# Altium project RobotHead.PrjPcb
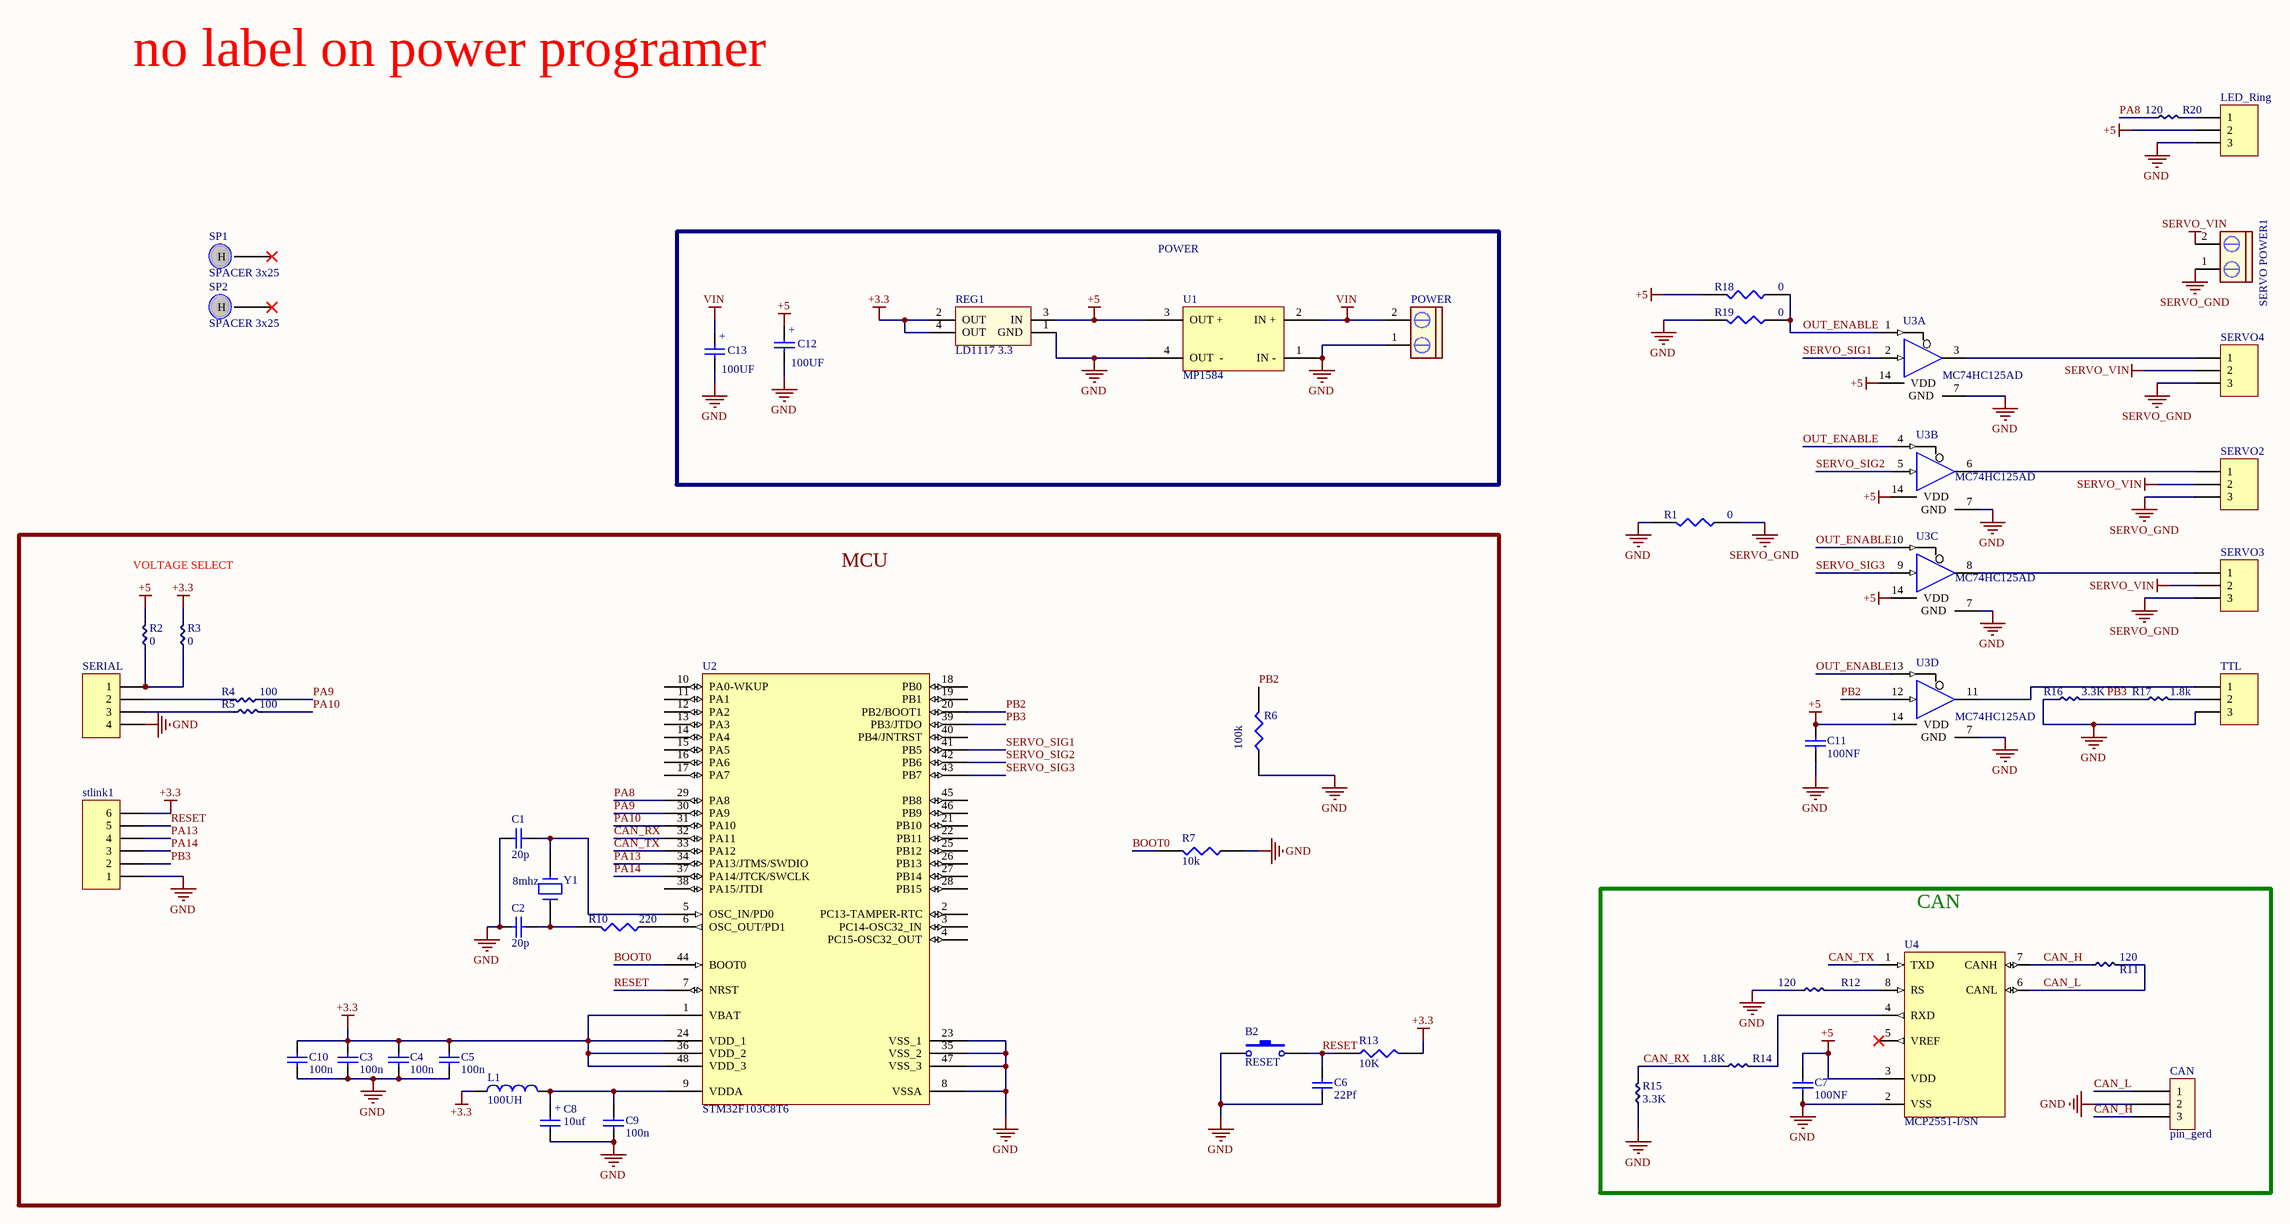
[diagram p0: Head.SchDoc]
1 sheet, 51 parts. Net scope: global (net labels, ports and power ports of the same name join across sheets).
Board file: HEAD.PcbDoc

## Sheet Head.SchDoc
size A2

### Parts
B2  RESET  [SMD PUSH BUTTON]
C1  20p  [MY_CAP_SMD_0805]
C2  20p  [MY_CAP_SMD_0805]
C3  100n  [MY_CAP_SMD_0805]
C4  100n  [MY_CAP_SMD_0805]
C5  100n  [MY_CAP_SMD_0805]
C6  22Pf  [MY_CAP_SMD_0805]
C7  100NF  [MY_CAP_SMD_0805]
C8  10uf  [MY_cap_smd10uf]
C9  100n  [MY_CAP_SMD_0805]
C10  100n  [MY_CAP_SMD_0805]
C11  100NF  [MY_CAP_SMD_0805]
C12  100UF  [MY_CAP_POL 5MM]
C13  100UF  [MY_CAP_POL 5MM]
CAN  pin_gerd  [MY_PINGERD3]
L1  100UH  [MY_SMD_INDUCTOR]
LED_Ring  Header 3  [My_1X03]  (value not drawn)
POWER  CON2 pin blue  [My_CN2]  (value not drawn)
R1  0  [MY_RES_SMD_0805]
R2  0  [MY_RES_SMD_0805]
R3  0  [MY_RES_SMD_0805]
R4  100  [MY_RES_SMD_0805]
R5  100  [MY_RES_SMD_0805]
R6  100k  [MY_RES_SMD_0805]
R7  10k  [MY_RES_SMD_0805]
R10  220  [MY_RES_SMD_0805]
R11  120  [MY_RES_SMD_0805]
R12  120  [MY_RES_SMD_0805]
R13  10K  [MY_RES_SMD_0805]
R14  1.8K  [MY_RES_SMD_0805]
R15  3.3K  [MY_RES_SMD_0805]
R16  3.3K  [MY_RES_SMD_0805]
R17  1.8k  [MY_RES_SMD_0805]
R18  0  [MY_RES_SMD_0805]
R19  0  [MY_RES_SMD_0805]
R20  120  [MY_RES_SMD_0805]
REG1  LD1117 3.3  [MY_LD1117-3.3]
SERIAL  Header 4  [My_1X04]  (value not drawn)
SERVO2  Header 3  [My_1X03]  (value not drawn)
SERVO3  Header 3  [My_1X03]  (value not drawn)
SERVO4  Header 3  [My_1X03]  (value not drawn)
SERVO_POWER1  CON2 pin blue  [My_CN2]  (value not drawn)
SP1  SPACER 3x25  [MY_SPACER 3X25MM]
SP2  SPACER 3x25  [MY_SPACER 3X25MM]
stlink1  Header 6  [My_1X06]  (value not drawn)
TTL  Header 3  [My_1X03]  (value not drawn)
U1  MP1584  [mp1584]
U2  STM32F103C8T6  [LQFP48_N]
U3  MC74HC125AD  [751A-02_N]  (parts A,B,C,D of 4)
U4  MCP2551-I/SN  [SOIC-SN8_N]
Y1  8mhz  [My_Crystal - SMD]

### Blocks framed on the sheet
POWER: C12 C13 POWER REG1 U1
MCU: B2 C1-C6 C8-C10 L1 R2-R7 R10 R13 SERIAL stlink1 U2 Y1
CAN: C7 CAN R11 R12 R14 R15 U4

### Nets
+3.3: C3.2 C4.2 C5.2 C10.2 L1.1 R3.2 R13.2 REG1.2(OUT) REG1.4(OUT) stlink1.6 U2.1(VBAT) U2.24(VDD_1) U2.36(VDD_2) U2.48(VDD_3)
+5: C7.2 C11.2 C12.+ LED_Ring.2 R2.2 R18.2 REG1.3(IN) U1.3(OUT_+) U3.14(VDD) U4.3(VDD)
GND: B2.1 C1.2 C2.1 C3.1 C4.1 C5.1 C6.1 C7.1 C8.- C9.1 C10.1 C11.1 C12.- C13.- CAN.2 LED_Ring.3 POWER.1 R1.2 R6.1 R7.1 R12.1 R15.1 R16.1 R19.2 REG1.1(GND) SERIAL.4 stlink1.1 TTL.3 U1.1(IN_-) U1.4(OUT__-) U2.8(VSSA) U2.23(VSS_1) U2.35(VSS_2) U2.47(VSS_3) U3.7(GND) U4.2(VSS)
SERVO_GND: R1.1 SERVO2.3 SERVO3.3 SERVO4.3 SERVO_POWER1.1
SERVO_VIN: SERVO2.2 SERVO3.2 SERVO4.2 SERVO_POWER1.2
VIN: C13.+ POWER.2 U1.2(IN_+)
BOOT0: R7.2 U2.44(BOOT0)
CAN_H: CAN.3 R11.1 U4.7(CANH)
CAN_L: CAN.1 R11.2 U4.6(CANL)
CAN_RX: R14.1 R15.2 U2.32(PA11)
CAN_TX: U2.33(PA12) U4.1(TXD)
OUT_ENABLE: R18.1 R19.1 U3.1(~{OE}) U3.4(~{OE}) U3.10(~{OE}) U3.13(~{OE})
PA8: R20.1 U2.29(PA8)
PA9: R4.1 U2.30(PA9)
PA10: R5.2 U2.31(PA10)
PA13: stlink1.4 U2.34(PA13/JTMS/SWDIO)
PA14: stlink1.3 U2.37(PA14/JTCK/SWCLK)
PB2: R6.2 U2.20(PB2/BOOT1) U3.12(A)
PB3: R16.2 R17.1 stlink1.2 U2.39(PB3/JTDO)
RESET: B2.2 C6.2 R13.1 stlink1.5 U2.7(NRST)
SERVO_SIG1: U2.41(PB5) U3.2(A)
SERVO_SIG2: U2.42(PB6) U3.5(A)
SERVO_SIG3: U2.43(PB7) U3.9(A)
NetC1_1: C1.1 U2.5(OSC_IN/PD0) Y1.2
NetC2_2: C2.2 R10.2 Y1.1
NetC8_+: C8.+ C9.2 L1.2 U2.9(VDDA)
NetLED_Ring_1: LED_Ring.1 R20.2
NetR2_1: R2.1 R3.1 SERIAL.1
NetR4_2: R4.2 SERIAL.2
NetR5_1: R5.1 SERIAL.3
NetR10_1: R10.1 U2.6(OSC_OUT/PD1)
NetR12_2: R12.2 U4.8(RS)
NetR14_2: R14.2 U4.4(RXD)
NetR17_2: R17.2 TTL.2
NetSERVO2_1: SERVO2.1 U3.6(Y)
NetSERVO3_1: SERVO3.1 U3.8(Y)
NetSERVO4_1: SERVO4.1 U3.3(Y)
NetTTL_1: TTL.1 U3.11(Y)

Not connected (* = marked no-connect by the designer): SP1 0(H)*; SP2 0(H)*; U2 2(PC13-TAMPER-RTC) 3(PC14-OSC32_IN) 4(PC15-OSC32_OUT) 10(PA0-WKUP) 11(PA1) 12(PA2) 13(PA3) 14(PA4) 15(PA5) 16(PA6) 17(PA7) 18(PB0) 19(PB1) 21(PB10) 22(PB11) 25(PB12) 26(PB13) 27(PB14) 28(PB15) 38(PA15/JTDI) 40(PB4/JNTRST) 45(PB8) 46(PB9); U4 5(VREF)*

### Notes on the sheet
- no label on power programer
- VOLTAGE SELECT

### Library data of the parts
B2 = SMD_PUSH_BUTTON
C1-C6 C9 C10 = CAP SMD
C7 C11 = CAP SMD_0805: 2.0 mm × 1.25 mm
C8 = cap_smd_10u
C12 C13 = Cap Pol_5mm: CAP-3300Uf; Value: 3300u
CAN = pin_gerd: 3pin
L1 = INDUCTOR SMD
LED_Ring SERVO2-SERVO4 TTL = Header 3: Header, 3-Pin; LatestRevisionDate: 17-Jul-2002; LatestRevisionNote: Re-released for DXP Platform.; Publisher: Altium Limited
POWER SERVO_POWER1 = CON2 pin blue: Connector blue screw
R1 R6 R7 R10 R13 R18 R19 = RES SMD
R2-R5 R11 R12 R14-R17 R20 = RES SMD 0805
SERIAL = Header 4: Header, 4-Pin; LatestRevisionDate: 17-Jul-2002; LatestRevisionNote: Re-released for DXP Platform.; Publisher: Altium Limited
SP1 SP2 = SPACER 3x25: SACER 3MM
stlink1 = Header 6: Header, 6-Pin; LatestRevisionDate: 17-Jul-2002; LatestRevisionNote: Re-released for DXP Platform.; Publisher: Altium Limited
U1 = MP1584: SWITCHING REGULATOR MODULE
U2 = STM32F103C8T6: STM32 ARM-based 32-bit MCU with 64 Kbytes Flash, 48-pin LQFP, Industrial Temperature; Published: 30-May-2008; DatasheetVersion: rev6, Mar-2008; PackageVersion: Mar-2008; PackageReference: LQFP48; Publisher: Altium Limited; PackageDescription: 48-Pin Low-Profile Quad Flat Pack, 7 x 7 mm Body, 0.5 mm Pitch (LQFP48); ComponentLink1Description: Manufacturer Link; ComponentLink1URL: www.st.com/stm32; ComponentLink2Description: Datasheet; ComponentLink2URL: http://www.st.com/stonline/products/literature/ds/13587.pdf; Link: https://www.javanelec.com/Shops?searchFilter=stm32f103#dtl/8649
U3 = MC74HC125AD: Quad 3-State Non-Inverting Buffer; Published: 17-Jul-2002; LatestRevisionDate: 13-Apr-2006; LatestRevisionNote: IPC-7351 Footprint Added.; DatasheetVersion: 1989; PackageVersion: 1991; PackageReference: 751A-02; Publisher: Altium Limited; PackageDescription: 14-Pin Small Outline Integrated Circuit 1.27 mm Pitch; Code_IPC: SOIC127P600-14; ComponentLink1Description: Manufacturer Link; ComponentLink1URL: http://www.onsemi.com/site/products/parametrics/0,4446,178,00.html
U4 = MCP2551-I/SN: High-Speed CAN Transceiver, 8-Pin SOIC, Industrial Temperature; Published: 29-Jan-2009; DatasheetVersion: revE, Jan-2007; PackageVersion: revAW, Oct-2008; PackageReference: SOIC-SN8; Publisher: Altium Limited; PackageDescription: 8-Lead Plastic Small Outline (SN) - Narrow, 3.90mm Body [SOIC]; Code_JEDEC: MS-012; Code_IPC: SOIC127P600-8; ComponentLink1Description: Manufacturer Link; ComponentLink1URL: http://www.microchip.com; ComponentLink2Description: Datasheet; ComponentLink2URL: http://ww1.microchip.com/downloads/en/DeviceDoc/21667E.pdf; ComponentLink3Description: Packaging Specification; ComponentLink3URL: http://ww1.microchip.com/downloads/en/PackagingSpec/00049AW.pdf
Y1 = CRYSTAL